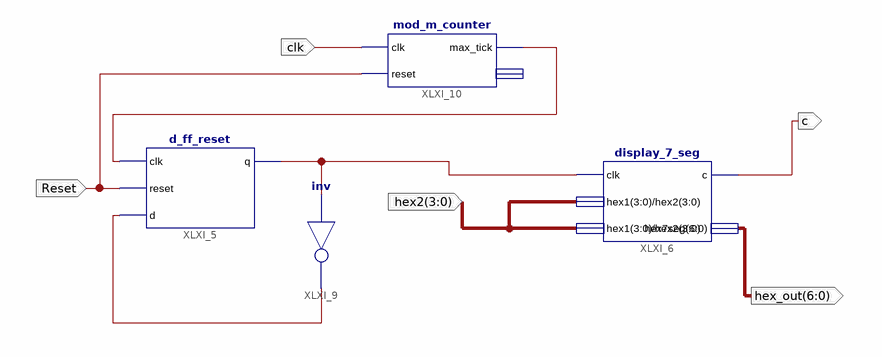
[diagram p0: schematic sheet 1]
// Xilinx ISE schematic Sche.sch (spartan3e) as structural Verilog: 4 symbols, 5 ports
module Sche (
  input  Reset,
  input  clk,
  input  [3:0] hex2,
  output [6:0] hex_out,
  output c
);

  wire XLXN_1, XLXN_8, XLXN_31;

  d_ff_reset XLXI_5 (.clk(XLXN_31), .reset(Reset), .d(XLXN_8), .q(XLXN_1));
  not XLXI_9 (XLXN_8, XLXN_1);
  mod_m_counter XLXI_10 (.clk(clk), .reset(Reset), .max_tick(XLXN_31));  // open: q
  display_7_seg XLXI_6 (.clk(XLXN_1), .hex1(hex2), .hex2(hex2), .c(c), .hex7seg(hex_out));
endmodule
